# Altium schematic sheet WiCam_DAC.SchDoc
size B
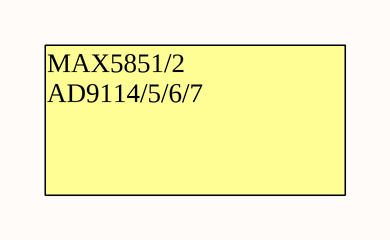
[diagram p0: WiCam_DAC.SchDoc]

## Notes on the sheet
- MAX5851/2
  AD9114/5/6/7